# Altium schematic sheet 13 HDMI TX_RTC.SchDoc: CM4 IO
size 297 x 209 mm; Page Create Date: March  8, 1995; Page Number: 13; Page Size: A4; Comment: radxa_1010; Page Count: 19; RevCode: V1.10; Doc: 13 HDMI TX/RTC; DsnPath: D:\WMS\黄工\[RC126]CM4_IO_V1.10\[RC126]_V1.10\CM4 IO_V1.10.DSN; SchematicName: CM4 IO V1.10; PageName: 13 HDMI TX/RTC; PageSize: A4; TopSchematic: True
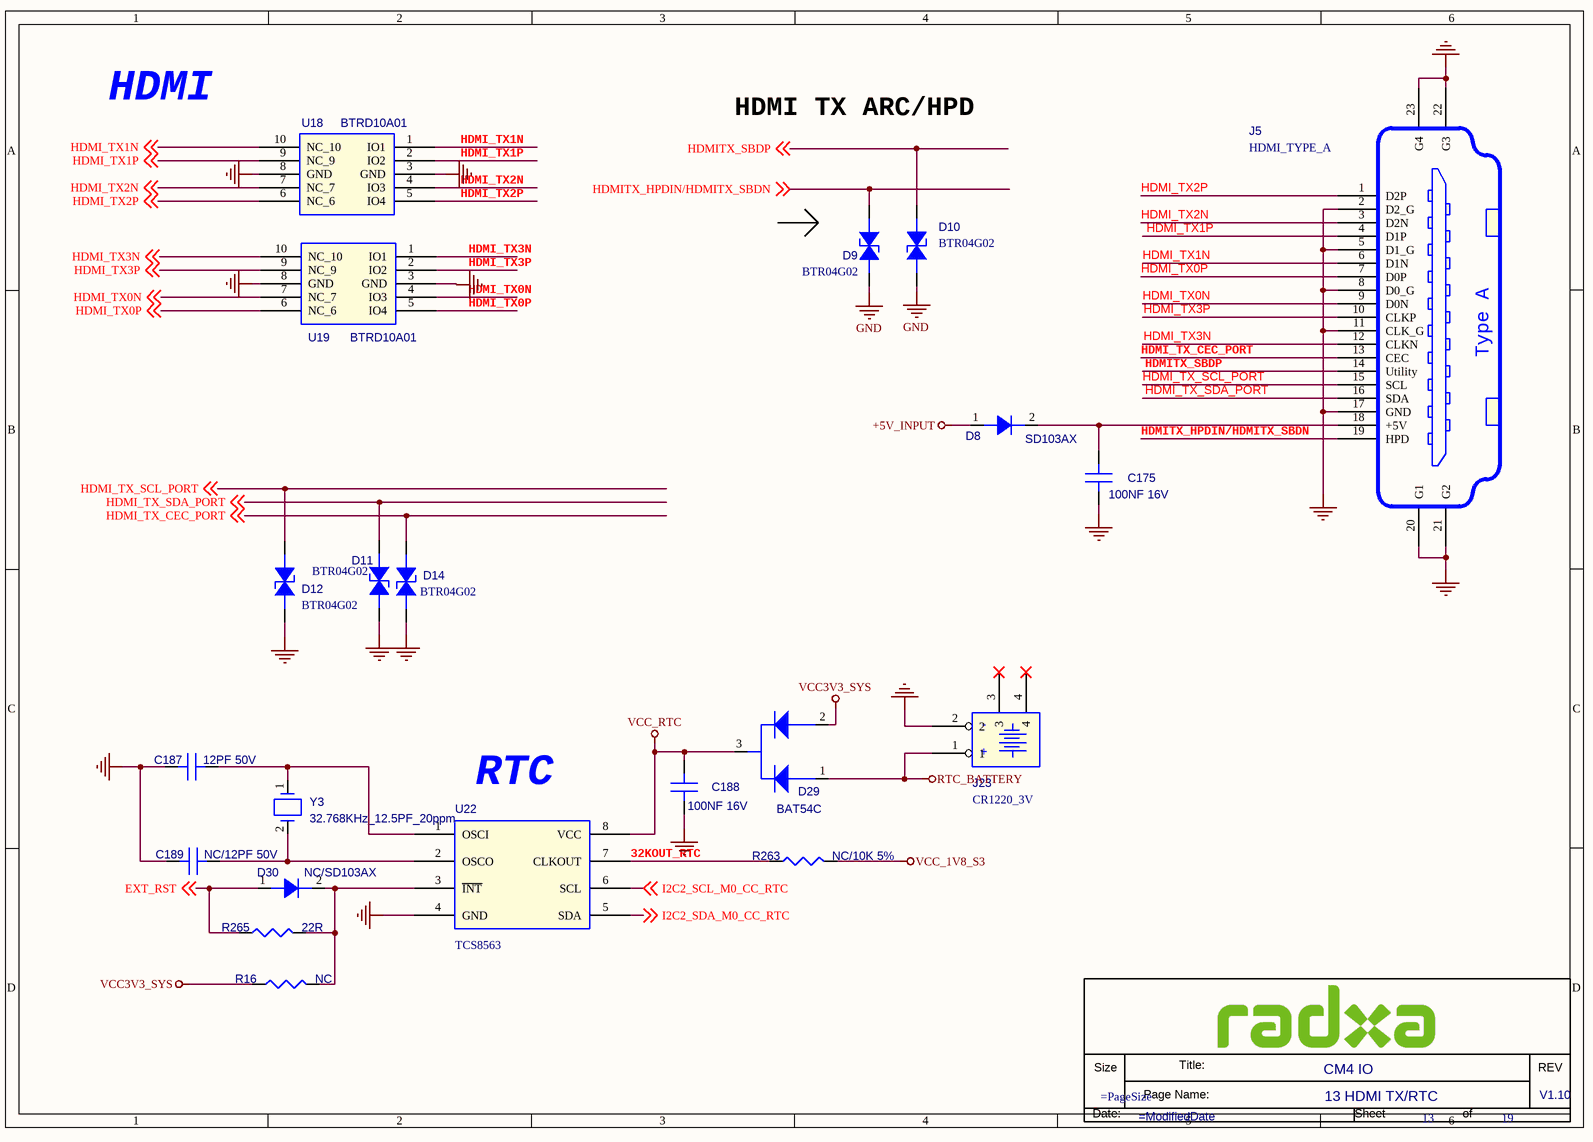
[diagram p0: 13 HDMI TX_RTC.SchDoc]

## Parts
*  Doc: 13 HDMI TX/RTC  RevCode: V1.10  Title: CM4 IO  Page Number: 13  Page Count: 19  (hidden comment: radxa_1010)  (graphical)
C175  100NF 16V  [C0201]
C187  12PF 50V  [C0201]
C188  100NF 16V  [C0201]
C189  NC/12PF 50V  [C0201]
D8  SD103AX  [SOD_523]
D9  BTR04G02  [DFN1006-2L]
D10  BTR04G02  [DFN1006-2L]
D11  BTR04G02  [DFN1006-2L]
D12  BTR04G02  [DFN1006-2L]
D14  BTR04G02  [DFN1006-2L]
D29  BAT54C  [23ACA]
D30  NC/SD103AX  [SOD_523]
J5  HDMI_TYPE_A  [CON_HDMI_TH_19P_STA]
J23  CR1220_3V  [BAT_SM2_12X2]
R16  NC  [R0402]
R263  NC/10K 5%  [R0402]
R265  22R  [R0402]
U18  BTRD10A01  [SON10_0D5_1]
U19  BTRD10A01  [SON10_0D5_1]
U22  TCS8563  [MSOP8_0D65_3]
Y3  32.768KHz_12.5PF_20ppm  [OSC_SM2_3D2X1D5]

## Nets
+5V_INPUT: D8.1(A)
GND: C175.2(B) C187.1(A) C188.2(B) C189.1(A) D9.2(CATHODE) D10.2(CATHODE) D11.2(CATHODE) D12.2(CATHODE) D14.2(CATHODE) J5.2(D2_G) J5.5(D1_G) J5.8(D0_G) J5.11(CLK_G) J5.17(GND) J5.20(G1) J5.21(G2) J5.22(G3) J5.23(G4) J23.2 U18.3(GND) U18.8(GND) U19.3(GND) U19.8(GND) U22.4(GND)
RTC_BATTERY: D29.1(A1) J23.1
VCC3V3_SYS: D29.2(A2) R16.1
VCC_1V8_S3: R263.1
VCC_RTC: C188.1(A) D29.3(C) U22.8(VCC)
32KOUT_RTC: R263.2 U22.7(CLKOUT)
EXT_RST: D30.1(A) R265.1 ; off-sheet EXT_RST
HDMI_TX0N: J5.9(D0N) U19.4(IO3) U19.7(NC_7) ; off-sheet HDMI_TX0N
HDMI_TX0P: J5.7(D0P) U19.5(IO4) U19.6(NC_6) ; off-sheet HDMI_TX0P
HDMI_TX1N: J5.6(D1N) U18.1(IO1) U18.10(NC_10) ; off-sheet HDMI_TX1N
HDMI_TX1P: J5.4(D1P) U18.2(IO2) U18.9(NC_9) ; off-sheet HDMI_TX1P
HDMI_TX2N: J5.3(D2N) U18.4(IO3) U18.7(NC_7) ; off-sheet HDMI_TX2N
HDMI_TX2P: J5.1(D2P) U18.5(IO4) U18.6(NC_6) ; off-sheet HDMI_TX2P
HDMI_TX3N: J5.12(CLKN) U19.1(IO1) U19.10(NC_10) ; off-sheet HDMI_TX3N
HDMI_TX3P: J5.10(CLKP) U19.2(IO2) U19.9(NC_9) ; off-sheet HDMI_TX3P
HDMI_TX_CEC_PORT: D14.1(ANODE) J5.13(CEC) ; off-sheet HDMI_TX_CEC_PORT
HDMI_TX_SCL_PORT: D12.1(ANODE) J5.15(SCL) ; off-sheet HDMI_TX_SCL_PORT
HDMI_TX_SDA_PORT: D11.1(ANODE) J5.16(SDA) ; off-sheet HDMI_TX_SDA_PORT
HDMITX_HPDIN/HDMITX_SBDN: D9.1(ANODE) J5.19(HPD) ; off-sheet HDMITX_HPDIN/HDMITX_SBDN
HDMITX_SBDP: D10.1(ANODE) J5.14(Utility) ; off-sheet HDMITX_SBDP
I2C2_SCL_M0_CC_RTC: U22.6(SCL) ; off-sheet I2C2_SCL_M0_CC_RTC
I2C2_SDA_M0_CC_RTC: U22.5(SDA) ; off-sheet I2C2_SDA_M0_CC_RTC
NetC175_1: C175.1(A) D8.2(K) J5.18(+5V)
NetC187_2: C187.2(B) U22.1(OSCI) Y3.1
NetC189_2: C189.2(B) U22.2(OSCO) Y3.2
NetD30_2: D30.2(K) R16.2 R265.2 U22.3(~{INT})

Not connected (* = marked no-connect by the designer): J23 3* 4*

## Notes on the sheet
- HDMI
- HDMI TX ARC/HPD
- (near U22) RTC
- (in symbol CR1220) -; +
- (in symbol HDMI_TYPE_A) Type A
- (in symbol radxa_1010) Size; Title:; REV; Page Name:; Date:; Sheet; of

## Library data of the parts
C175 = C: SMD  0201  100NF  16V  X5R  ±20%  ROHS; PARTS: 1; Part Reference: C175; Part Number: A1C01.00099; OriginalSymbolOrigin: (0,30); PKG_TYPE: CAP2-100-250; LEVEL: STD; PINSWAP: (A,B); Preferred: 6715f349cd0bc5; Value: 100NF 16V; Part Type: 陶瓷电容
C187 = C: SMD  0201  12PF  50V  COG  ±5%  ROHS; PARTS: 1; Part Reference: C187; Part Number: A1C01.00105; OriginalSymbolOrigin: (0,30); PKG_TYPE: CAP2-100-250; LEVEL: STD; PINSWAP: (A,B); Value: 12PF 50V; PCB Footprint: C0201; Part Type: 陶瓷电容
C188 = C: SMD  0201  100NF  16V  X5R  ±20%  ROHS; PARTS: 1; Part Reference: C188; Part Number: A1C01.00099; OriginalSymbolOrigin: (0,30); PKG_TYPE: CAP2-100-250; LEVEL: STD; PINSWAP: (A,B); Preferred: 6715f349cd0bc5; Value: 100NF 16V; Part Type: 陶瓷电容
C189 = C: SMD  0201  12PF  50V  COG  ±5%  ROHS; PARTS: 1; Part Reference: C189; Part Number: A1C01.00105; OriginalSymbolOrigin: (0,30); PKG_TYPE: CAP2-100-250; LEVEL: STD; PINSWAP: (A,B); Value: NC/12PF 50V; PCB Footprint: C0201; Part Type: 陶瓷电容
D8 = DIODE_Dup1: SMD  编带  SOD-523  SD103AX  CJ  ROHS; Part Reference: D8; Part Number: A1D02.00049; Manufacturer: 长电; RK PN: B5819WS; Priority: A; PCB Footprint: SOD_523; Value: SD103AX; Part Type: 二极管-ESD管-桥堆-TVS管; Manufacturer PN: B5819WS; Created by: JJJ
D9 = ESD: SMD  编带  0402  BTR04G02  B-tron  ROHS; Part Reference: D9; Part Number: A1D02.00002; Parameter: ESD-台舟 ESD5341N-封装 esd0402; ID: DE-E0004; Temp Coeff: -50℃ ~ +125℃; PCB Footprint: ESD_D0402; Value: BTR04G02; Part Type: 二极管-ESD管-桥堆-TVS管
D10 = ESD: SMD  编带  0402  BTR04G02  B-tron  ROHS; Part Reference: D10; Part Number: A1D02.00002; Parameter: ESD-台舟 ESD5341N-封装 esd0402; ID: DE-E0004; Temp Coeff: -50℃ ~ +125℃; PCB Footprint: ESD_D0402; Value: BTR04G02; Part Type: 二极管-ESD管-桥堆-TVS管
D11 = ESD: SMD  编带  0402  BTR04G02  B-tron  ROHS; Part Reference: D11; Part Number: A1D02.00002; Parameter: ESD-台舟 ESD5341N-封装 esd0402; ID: DE-E0004; Temp Coeff: -50℃ ~ +125℃; PCB Footprint: ESD_D0402; Value: BTR04G02; Part Type: 二极管-ESD管-桥堆-TVS管
D12 = ESD: SMD  编带  0402  BTR04G02  B-tron  ROHS; Part Reference: D12; Part Number: A1D02.00002; Parameter: ESD-台舟 ESD5341N-封装 esd0402; ID: DE-E0004; Temp Coeff: -50℃ ~ +125℃; PCB Footprint: ESD_D0402; Value: BTR04G02; Part Type: 二极管-ESD管-桥堆-TVS管
D14 = ESD: SMD  编带  0402  BTR04G02  B-tron  ROHS; Part Reference: D14; Part Number: A1D02.00002; Parameter: ESD-台舟 ESD5341N-封装 esd0402; ID: DE-E0004; Temp Coeff: -50℃ ~ +125℃; PCB Footprint: ESD_D0402; Value: BTR04G02; Part Type: 二极管-ESD管-桥堆-TVS管
D29 = DIODE_S_3P: SMD  编带  SOT-23  BAT54C  30V  0.2A  长电  ROHS; Part Reference: D29; Part Number: A1D02.00096; PCB Footprint: SOT_23; Temp Coeff: -55℃ to +150℃; Preferred: 6715f349cd0bc5; Value: BAT54C; Part Type: 二极管-ESD管-桥堆-TVS管
D30 = DIODE_Dup1: SMD  编带  SOD-523  SD103AX  CJ  ROHS; Part Reference: D30; Part Number: A1D02.00049; Manufacturer: 长电; RK PN: B5819WS; Priority: A; PCB Footprint: SOD_523; Value: NC/SD103AX; Part Type: 二极管-ESD管-桥堆-TVS管; Manufacturer PN: B5819WS; Created by: JJJ
J5 = HDMI_TYPE_A: DIP  TYPE-A  19PIN  180度  23*7.8*H16mm  镀镍  有定位柱  脚距6.5mm  4插件固定脚  WLDM-094E  ROHS; Part Reference: J5; Part Number: A1J13.00003; Parameter: 连接器-HDMI公母-19P/型号：10029449-001RLF-封装 hdmia19_hdmi_01a; Value: HDMI_TYPE_A; Part Type: HDMI座; PCB Footprint: CON_HDMI_TH_19P_STA
J23 = CR1220: SMD  电池座  2PIN  15.4*14.2*4.1mm  BS-12-B2AA002  美阳  ROHS; Part Reference: J23; Part Number: A1J14.00013; Temp Coeff: -25℃ to +85℃; Preferred: 6715f349cd0bc5; Value: CR1220_3V; Part Type: 其他座子
R16 = R: SMD  0201  10K  1/20W  ±5%  ROHS; Part Reference: R16; Part Number: A1R01.00012; PCB Footprint: R0201; Temp Coeff: －55℃ ~ ＋125℃; Value: NC; Part Type: 贴片电阻
R263 = R: SMD  0201  10K  1/20W  ±5%  ROHS; Part Reference: R263; Part Number: A1R01.00012; PCB Footprint: R0201; Temp Coeff: －55℃ ~ ＋125℃; Value: NC/10K 5%; Part Type: 贴片电阻
R265 = R: SMD  0201  0R  1/20W  ±5%  ROHS; Part Reference: R265; Part Number: A1R01.00027; PCB Footprint: R0201; Temp Coeff: －55℃ ~ ＋125℃; Value: 22R; Part Type: 贴片电阻
U18 = BTRD10A01: SMD  编带  DFN2510-10L  BTRD10A01  4Line  0.1pF  B-tron  ROHS; Part Reference: U18; Part Number: A1D02.00106; Temp Coeff: -55℃ to +125℃; Preferred: 6715f349cd0bc5; Value: BTRD10A01; Part Type: 二极管-ESD管-桥堆-TVS管
U19 = BTRD10A01: SMD  编带  DFN2510-10L  BTRD10A01  4Line  0.1pF  B-tron  ROHS; Part Reference: U19; Part Number: A1D02.00106; Temp Coeff: -55℃ to +125℃; Preferred: 6715f349cd0bc5; Value: BTRD10A01; Part Type: 二极管-ESD管-桥堆-TVS管
U22 = TCS8563: SMD  时钟  TCS8563-MH  MSOP8  TCS(汤诚)  ROHS; Part Reference: U22; Part Number: A1I01.00268; Preferred: 6715f349cd0bc5; Temp Coeff: -30℃ to +85℃; Value: TCS8563; PCB Footprint: MSOP8_0D65_3; Part Type: 集成电路/模块
Y3 = OSC_2P: SMD  编带  无源  3215  32.768KHz  12.5PF  ±20ppm  TAITIEN  XDMCZLNDDD-32.768KHz  ROHS; Part Reference: Y3; Part Number: A1Y01.00037; PCB Footprint: OSC_SM2_3D2X1D5; Value: 32.768KHz_12.5PF_20ppm; Part Type: 晶振
* = radxa_1010: Page Create Date: March  8, 1995; Page Size: =PageSize; Page Modify Date: =ModifiedDate